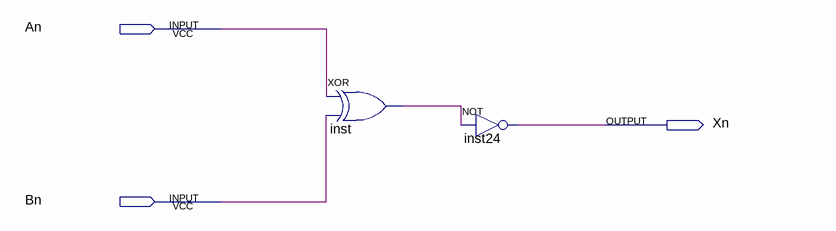
[diagram p0: schematic sheet]
// Quartus schematic X.bdf as structural Verilog: 2 symbols, 3 pins
module X (
  input  An,
  input  Bn,
  output Xn
);

  wire inst_out;

  xor inst (inst_out, An, Bn);
  not inst24 (Xn, inst_out);
endmodule
